# Altium schematic sheet Switch_SPDT.SchDoc
size A; SheetNumber: 10; SheetTotal: 17
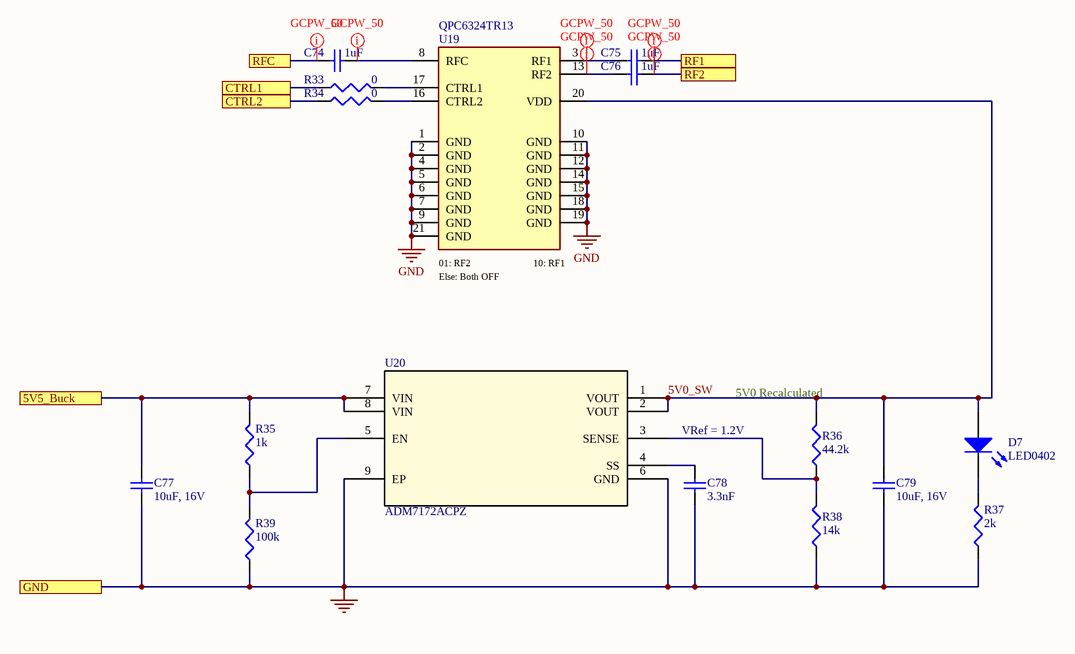
[diagram p0: Switch_SPDT.SchDoc]

## Parts
C74  1uF  [SMD-0402]
C75  1uF  [SMD-0402]
C76  1uF  [SMD-0402]
C77  10uF, 16V  [SMD-0603]
C78  3.3nF  [Johanson-0201]
C79  10uF, 16V  [SMD-0603]
D7  LED0402  [LED-0402]
R33  0  [SMD-0402]
R34  0  [SMD-0402]
R35  1k  [SMD-0402]
R36  44.2k  [SMD-0402]
R37  2k  [SMD-0402]
R38  14k  [SMD-0402]
R39  100k  [SMD-0402]
U19  QPC6324TR13  [Qorvo QFN50P400X400X90-21N-D]
U20  ADM7172ACPZ  [ADM7172_VIA_NOSILK]

## Ports
5V5_Buck, CTRL1, CTRL2, GND, RF1, RF2, RFC

## Nets
GND: C77.1 C78.1 C79.1 R37.1 R38.1 R39.1 U19.1(GND) U19.2(GND) U19.4(GND) U19.5(GND) U19.6(GND) U19.7(GND) U19.9(GND) U19.10(GND) U19.11(GND) U19.12(GND) U19.14(GND) U19.15(GND) U19.18(GND) U19.19(GND) U19.21(GND) U20.6(GND) U20.9(EP) ; port GND
5V0_SW: C79.2 D7.2(A) R36.2 U19.20(VDD) U20.1(VOUT) U20.2(VOUT)
5V5_Buck: C77.2 R35.2 U20.7(VIN) U20.8(VIN) ; port 5V5_Buck
CTRL1: R33.1 ; port CTRL1
CTRL2: R34.1 ; port CTRL2
RF1: C75.2 ; port RF1
RF2: C76.2 ; port RF2
RFC: C74.1 ; port RFC
NetC74_2: C74.2 U19.8(RFC)
NetC75_1: C75.1 U19.3(RF1)
NetC76_1: C76.1 U19.13(RF2)
NetC78_2: C78.2 U20.4(SS)
NetD7_1: D7.1(K) R37.2
NetR33_2: R33.2 U19.17(CTRL1)
NetR34_2: R34.2 U19.16(CTRL2)
NetR35_1: R35.1 R39.2 U20.5(EN)
NetR36_1: R36.1 R38.2 U20.3(SENSE)

## Layout directives
net class GCPW_50: NetC74_2, NetC75_1, NetC76_1, RF1, RF2, RFC

## Notes on the sheet
- (near R36) 5V0 Recalculated
- VRef = 1.2V
- (in symbol Qorvo QPC6324TR13) 01: RF2; 10: RF1; Else: Both OFF

## Library data of the parts
C74-C76 = CAP0402: Ceramic Capacitor 0402
C77 C79 = CAP0603: Ceramic Capacitor 0603
C78 = CAP0201: Capacitor 0201 Imperial
D7 = LED0402: LED 0402
R33-R39 = RES0402: Resistor-0402
U19 = Qorvo QPC6324TR13: 5 MHz to 6000 MHz Operation  Non-Reflective (RFX ports)  Terminated All-Off State mode  No Blocking Caps needed unless voltage is on RF Line  High Isolation: RFC-RFX: 63 dB at 2 GHz  RFX-RFX: 63 dB at 2 GHz  +1.8 V Logic Compatible; Manufacturer_Name: Qorvo; Geometry.Height: 0.9mm; Manufacturer_Part_Number: QPC6324TR13; Mouser Part Number: 772-QPC6324TR13; Mouser Price/Stock: https://www.mouser.co.uk/ProductDetail/Qorvo/QPC6324TR13?qs=W0yvOO0ixfHza5Li%252BN2uIg%3D%3D; Arrow Part Number: *; Arrow Price/Stock: *; Datasheet Link: https://www.qorvo.com/products/d/da006332
U20 = ADM7172ACPZ: 6.5V, 2A, Ultralow Noise, High PSRR, Fast Transient Response CMOS LDO; Value: Value; Type: Type; RefDes: RefDes